# Altium schematic sheet SW 12.schdoc
size 349 x 127 mm; SheetNumber: 1; SheetTotal: 1
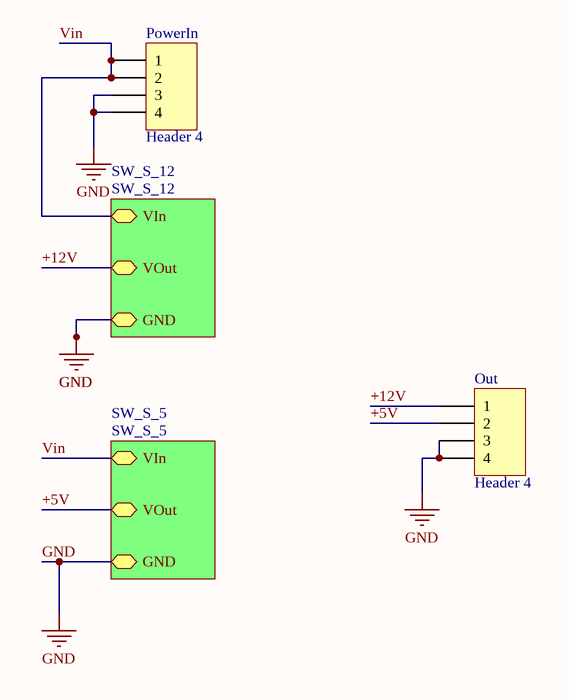
[diagram p0: SW 12.schdoc]

## Parts
Out  Header 4  [HDR1X4]
PowerIn  Header 4  [HDR1X4]

## Sub-sheets
SW_S_5 = SW_S_5: VIn, GND, VOut
SW_S_12 = SW_S_12: VIn, GND, VOut

## Nets
GND: Out.3 Out.4 PowerIn.3 PowerIn.4 ; sheet SW_S_12/GND, sheet SW_S_5/GND
+5V: Out.2 ; sheet SW_S_5/VOut
+12V: Out.1 ; sheet SW_S_12/VOut
Vin: PowerIn.1 PowerIn.2 ; sheet SW_S_12/VIn, sheet SW_S_5/VIn

## Library data of the parts
Out PowerIn = Header 4: Header, 4-Pin; LatestRevisionDate: 17-Jul-2002; LatestRevisionNote: Re-released for DXP Platform.; Publisher: Altium Limited